# Altium project TFT-ESP32-V1.PrjPcb
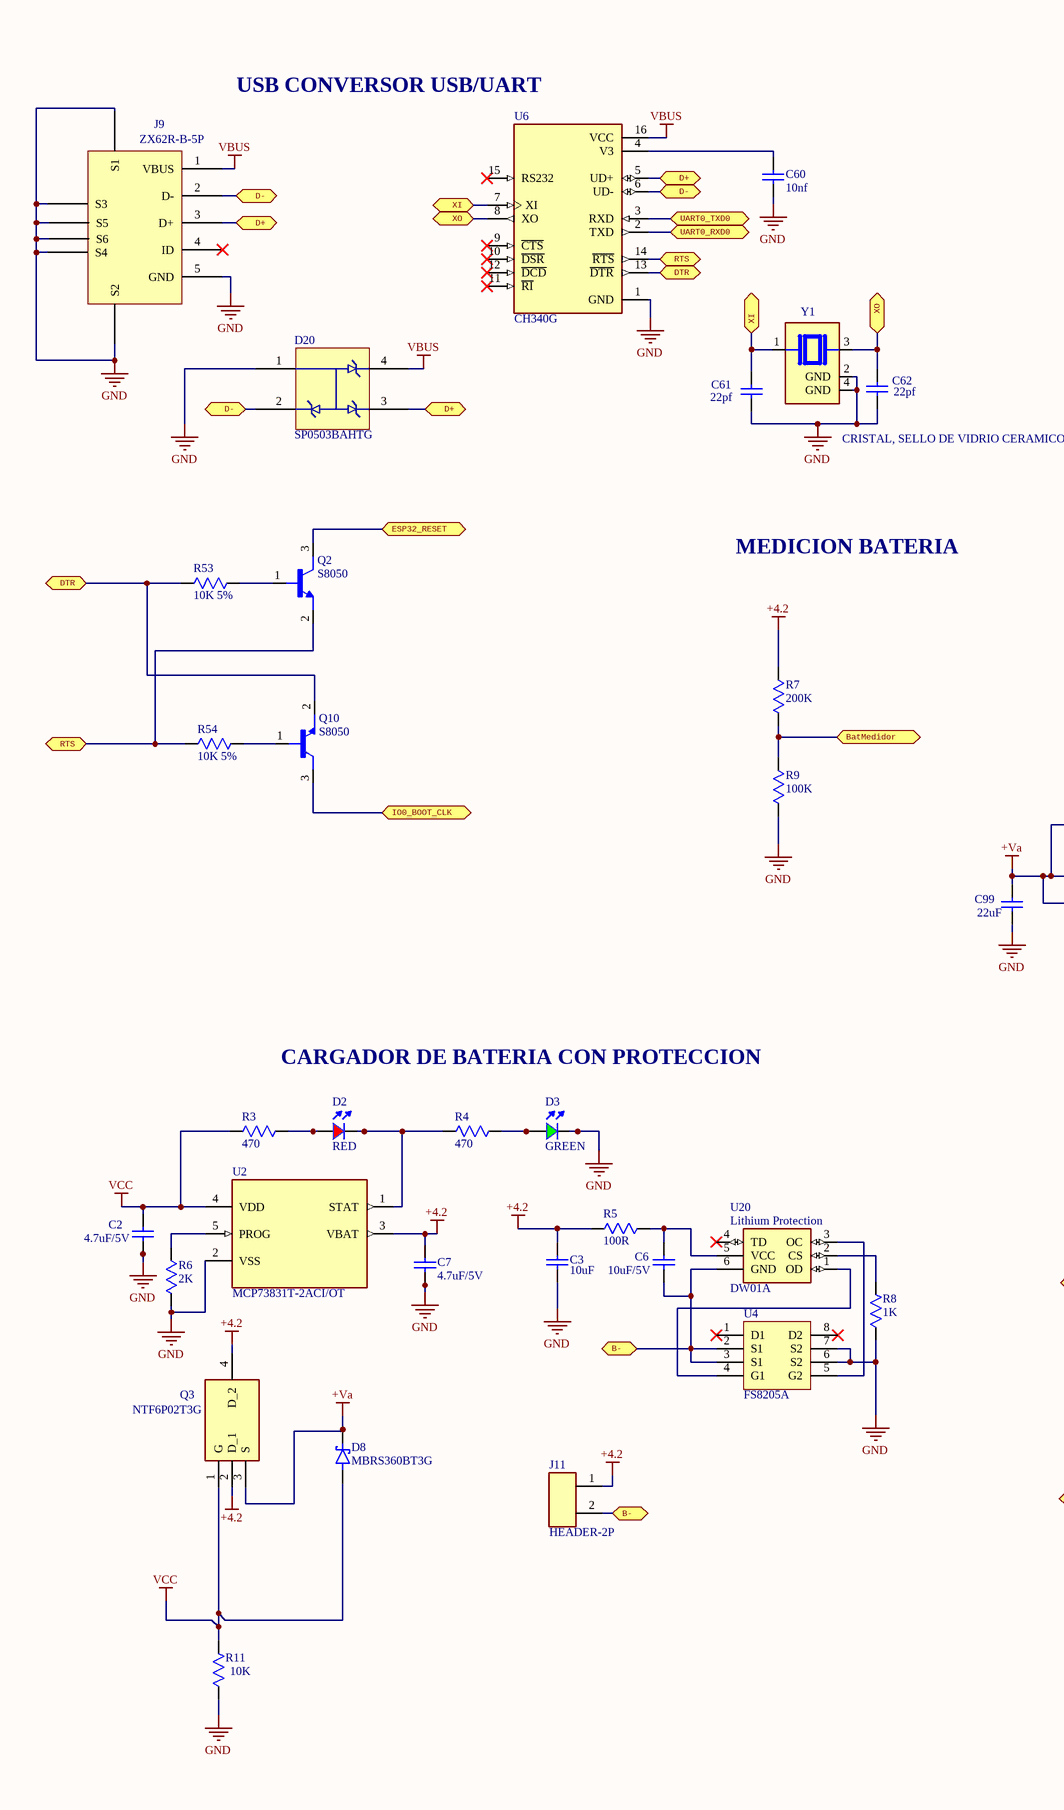
[diagram p0: TFT-ES32-V1.1.SchDoc, left]
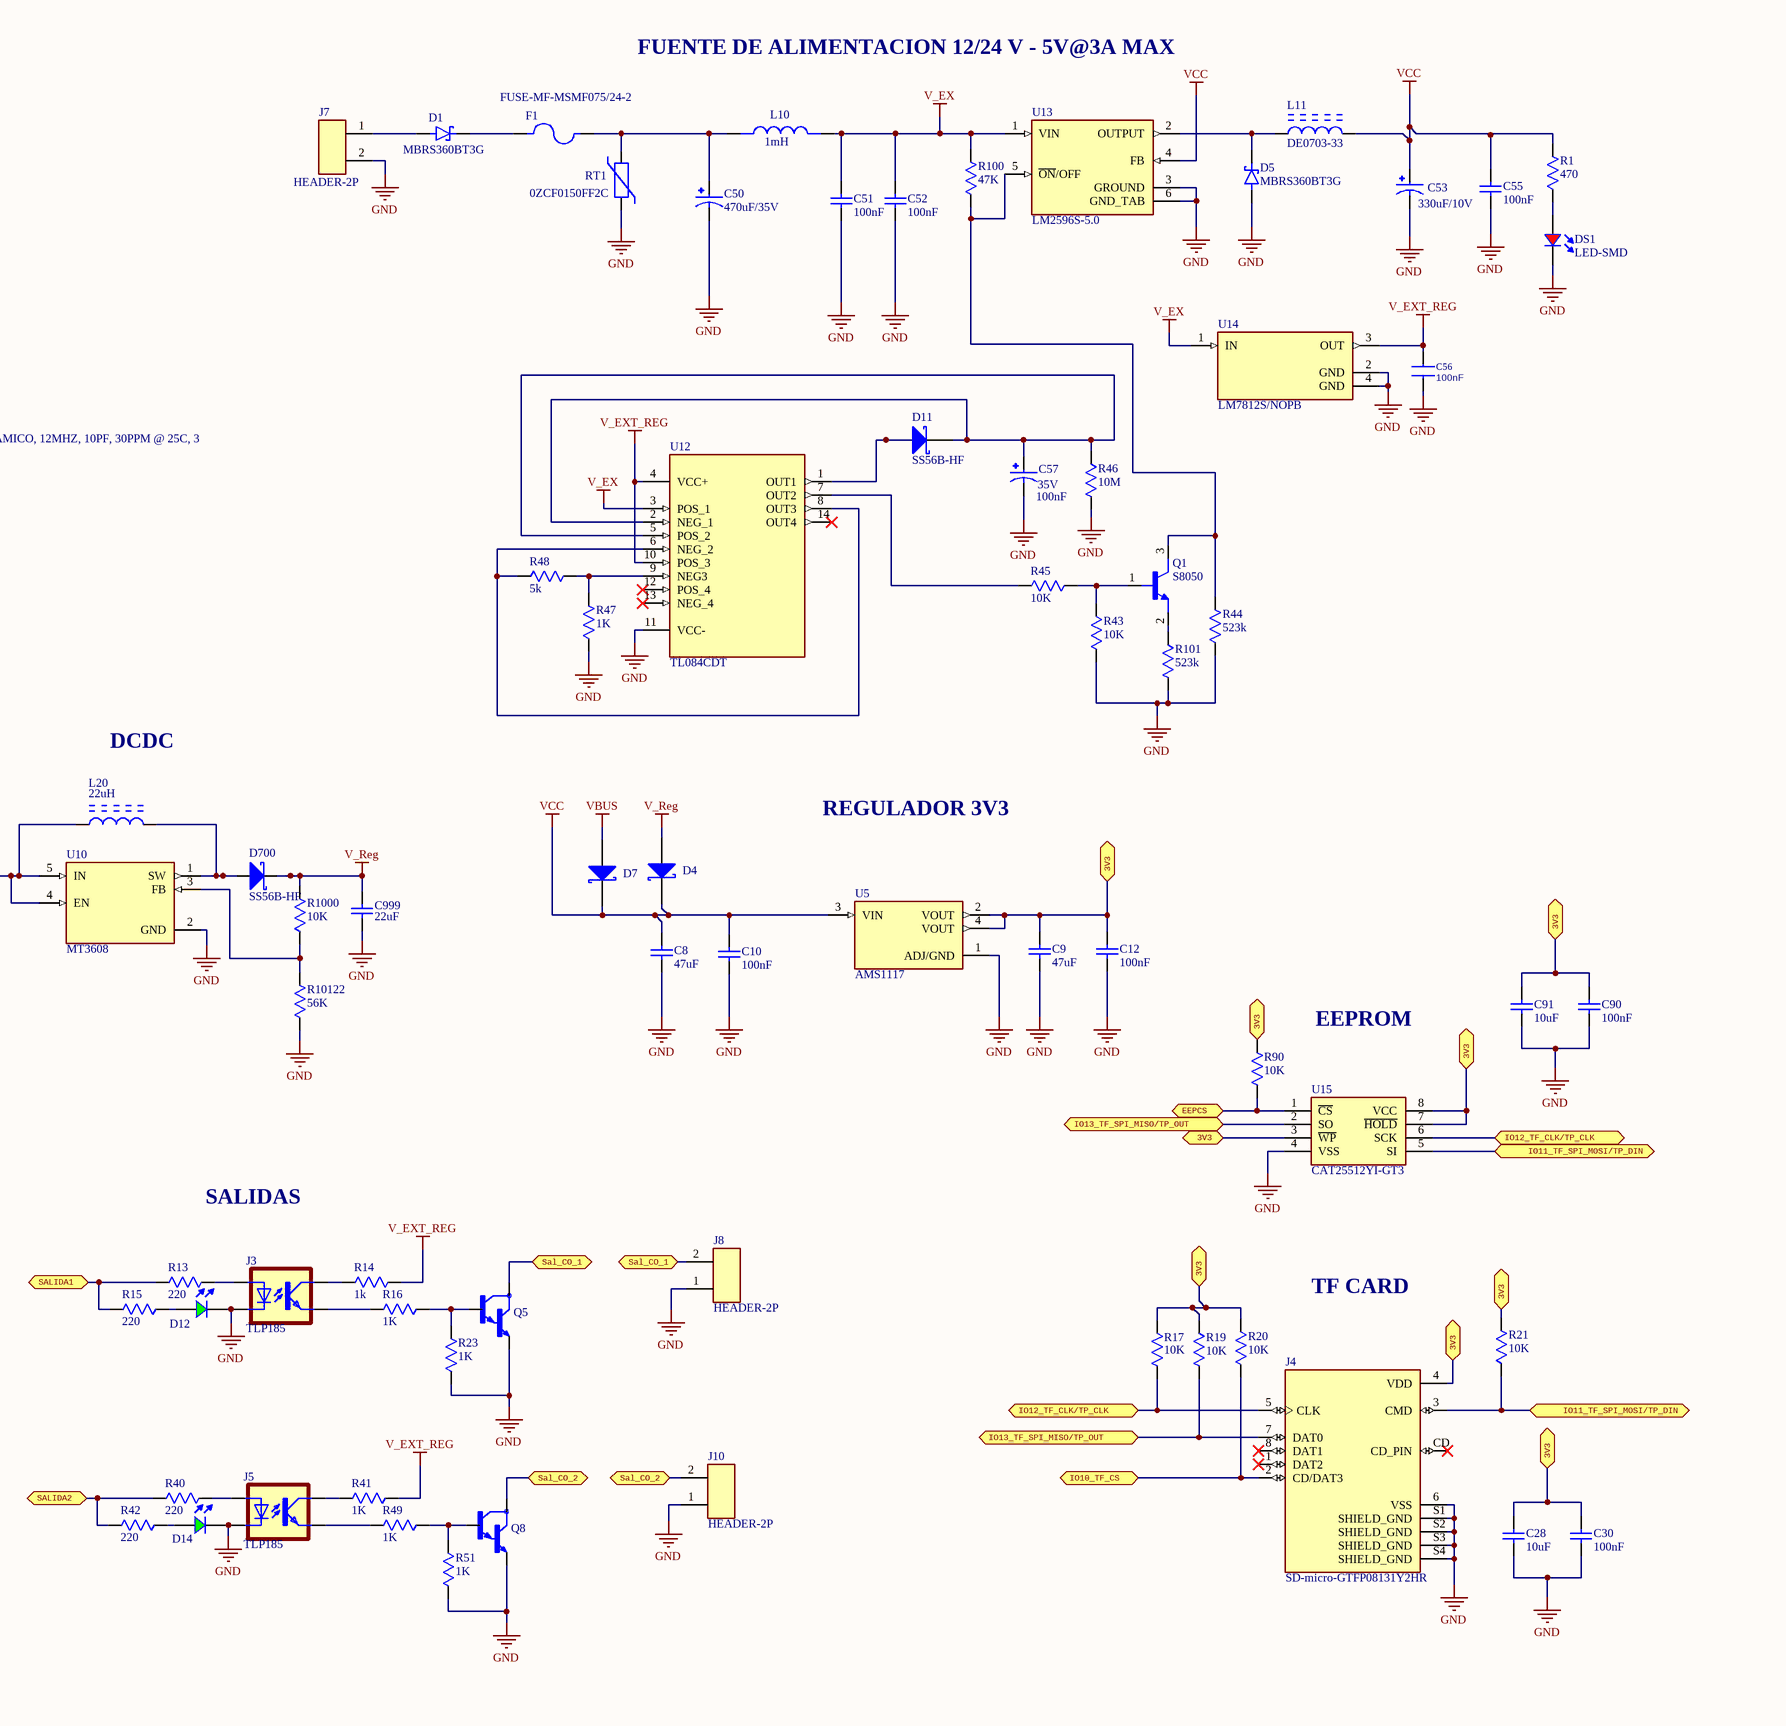
[diagram p1: TFT-ES32-V1.1.SchDoc, middle]
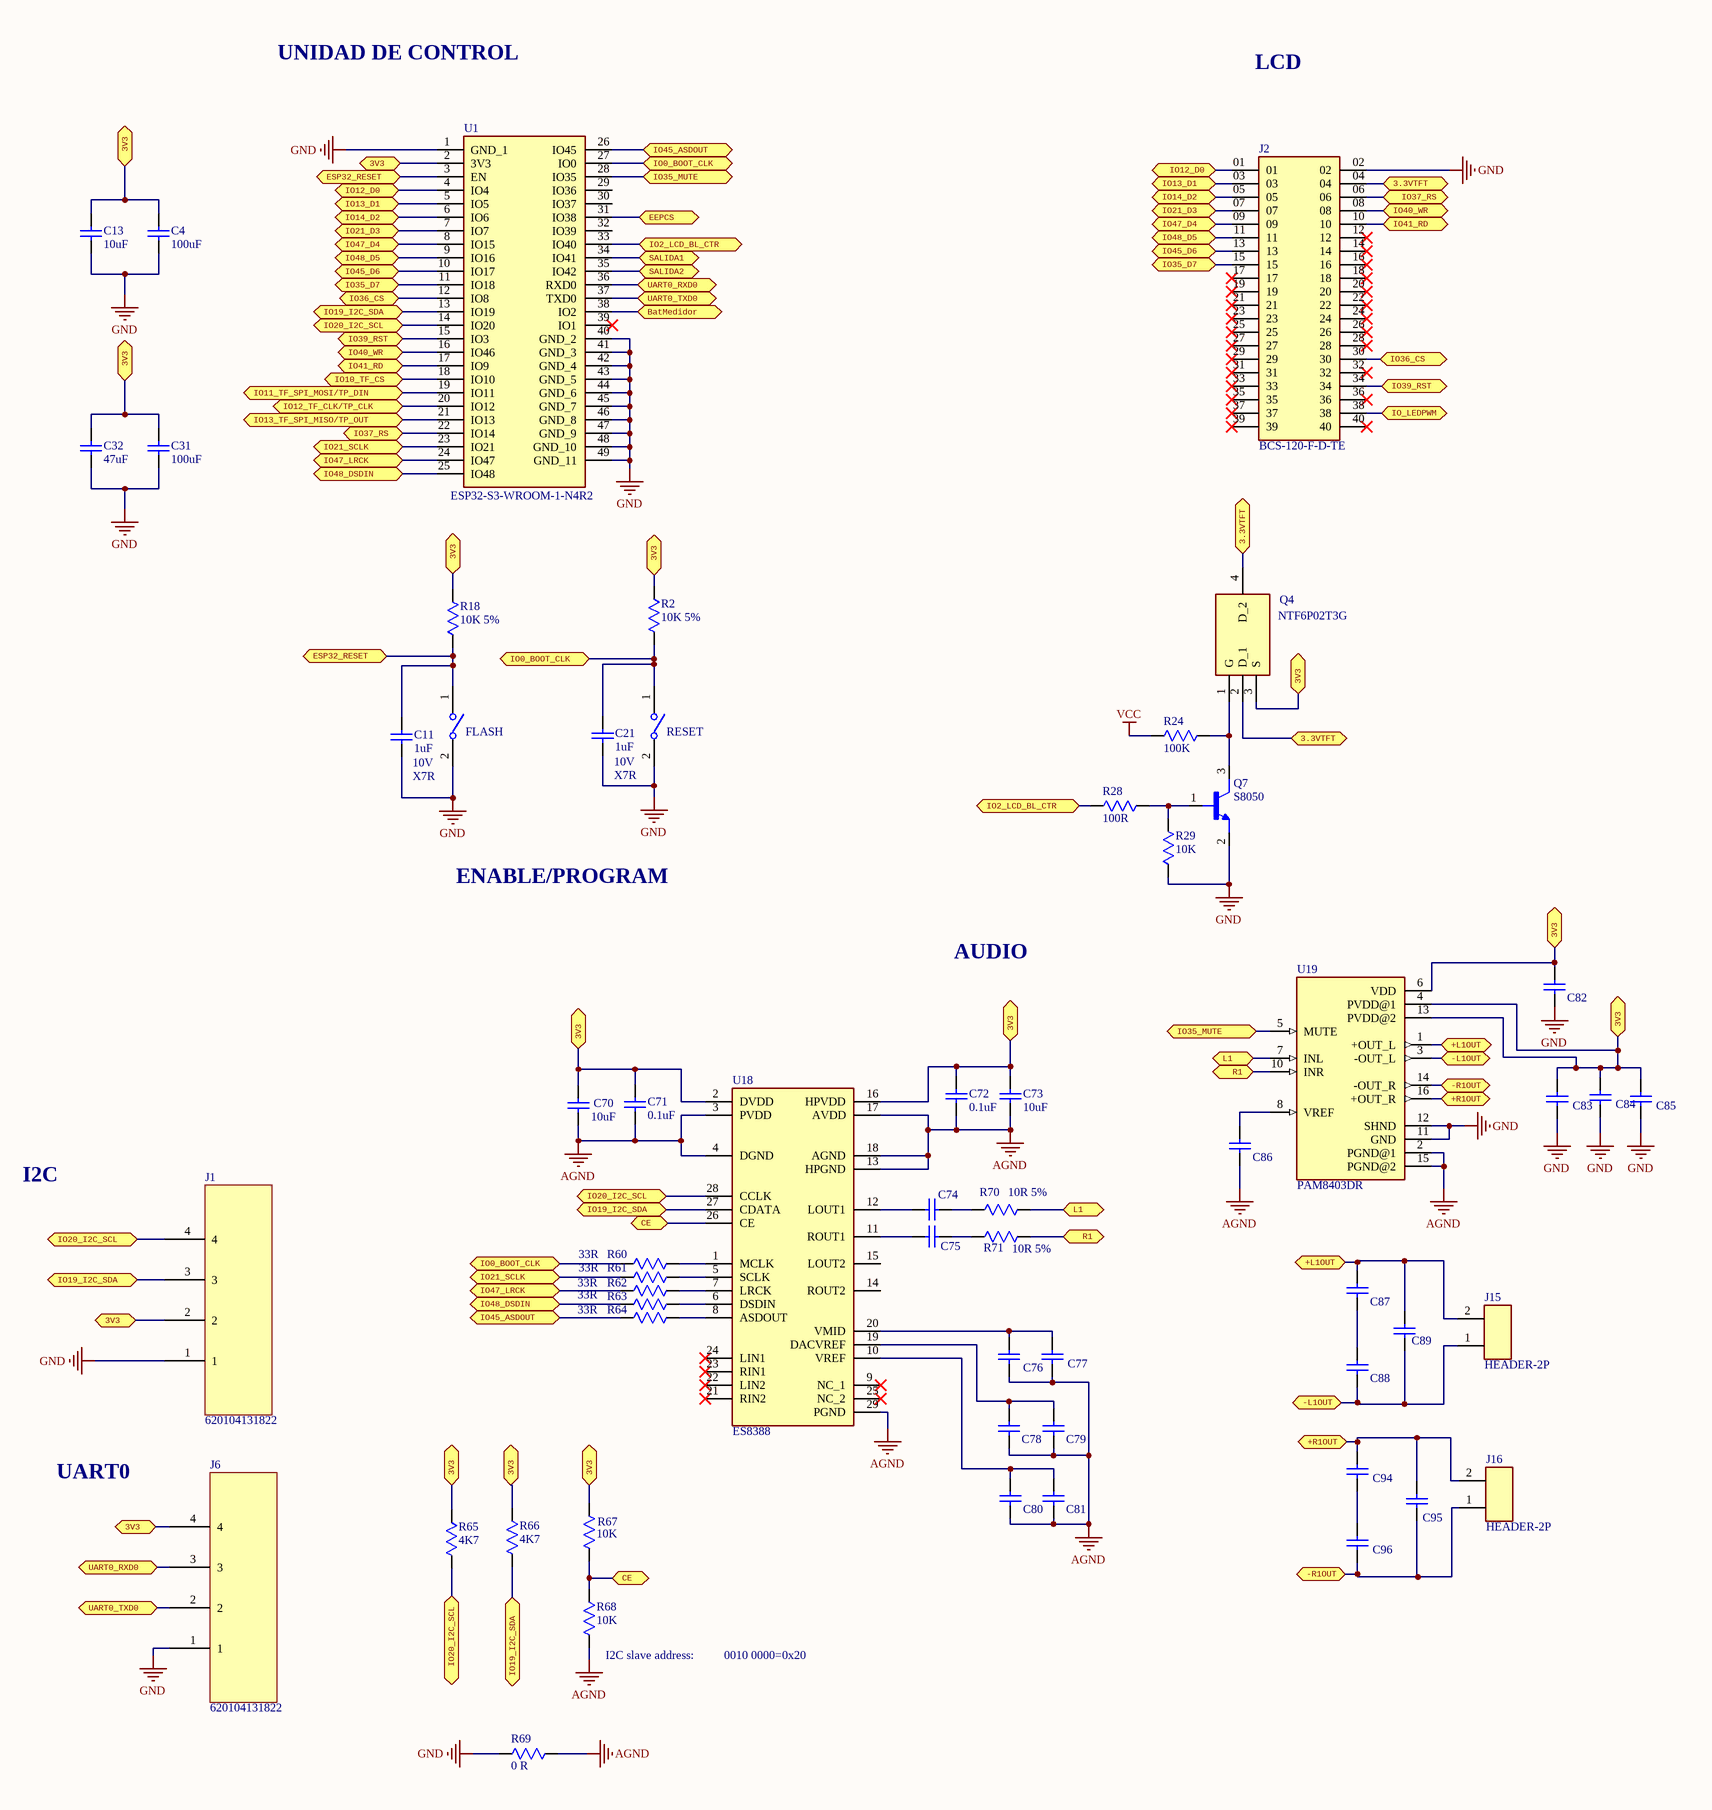
[diagram p2: TFT-ES32-V1.1.SchDoc, right]
1 sheet, 161 parts. Net scope: flat (ports and power ports of the same name join across sheets).
Board file: TFT-ES32-V1.PcbDoc

## Sheet TFT-ES32-V1.1.SchDoc
size 855 x 346 mm

### Parts
C2  4.7uF/5V  [C_0805-3D]
C3  10uF  [C_0805-3D]
C4  100uF  [C_0805-3D]
C6  10uF/5V  [C_0805-3D]
C7  4.7uF/5V  [C_0805-3D]
C8  47uF  [C_0805-3D]
C9  47uF  [C_0805-3D]
C10  100nF  [C_0805-3D]
C11  1uF  tension: 10V  tipo: X7R  [C_0805-3D]
C12  100nF  [C_0805-3D]
C13  10uF  [C_0805-3D]
C21  1uF  tension: 10V  tipo: X7R  [C_0805-3D]
C28  10uF  [C_0805-3D]
C30  100nF  [C_0805-3D]
C31  100uF  [C_0805-3D]
C32  47uF  [C_0805-3D]
C50  470uF/35V  [CAP_EEEFP1V221AV - duplicate]
C51  100nF  [C_0805-3D]
C52  100nF  [C_0805-3D]
C53  330uF/10V  [CAP_EEEFP1V221AV - duplicate]
C55  100nF  [C_0805-3D]
C56  100nF  [C_0805]
C57  value 100nF  max volt: 35V  [CAP_EEEFP1V221AV - duplicate]  (hidden comment: CAP)
C60  10nf  [C_0805-3D]
C61  value 22pf  [C_0805-3D]  (hidden comment: capacitor caramico)
C62  value 22pf  [C_0805-3D]  (hidden comment: capacitor caramico)
C70  10uF  [C_0805-3D]
C71  0.1uF  [C_0805-3D]
C72  0.1uF  [C_0805-3D]
C73  10uF  [C_0805-3D]
C74  capacitor caramico  [C_0805-3D]  (value not drawn)
C75  capacitor caramico  [C_0805-3D]  (value not drawn)
C76  capacitor caramico  [C_0805-3D]  (value not drawn)
C77  capacitor caramico  [C_0805-3D]  (value not drawn)
C78  capacitor caramico  [C_0805-3D]  (value not drawn)
C79  capacitor caramico  [C_0805-3D]  (value not drawn)
C80  capacitor caramico  [C_0805-3D]  (value not drawn)
C81  capacitor caramico  [C_0805-3D]  (value not drawn)
C82  capacitor caramico  [C_0805-3D]  (value not drawn)
C83  capacitor caramico  [C_0805-3D]  (value not drawn)
C84  capacitor caramico  [C_0805-3D]  (value not drawn)
C85  capacitor caramico  [C_0805-3D]  (value not drawn)
C86  capacitor caramico  [C_0805-3D]  (value not drawn)
C87  capacitor caramico  [C_0805-3D]  (value not drawn)
C88  capacitor caramico  [C_0805-3D]  (value not drawn)
C89  capacitor caramico  [C_0805-3D]  (value not drawn)
C90  100nF  [C_0805-3D]
C91  10uF  [C_0805-3D]
C94  capacitor caramico  [C_0805-3D]  (value not drawn)
C95  capacitor caramico  [C_0805-3D]  (value not drawn)
C96  capacitor caramico  [C_0805-3D]  (value not drawn)
C99  value 22uF  [C_0805-3D]  (hidden comment: capacitor caramico)
C999  value 22uF  [C_0805-3D]  (hidden comment: capacitor caramico)
D1  MBRS360BT3G  [DIOM5436X247N]
D2  RED  [D_0805-RED]
D3  GREEN  [D_0805-GREEN]
D4  SS56B-HF  [SS56B-HF DO-214AA (SMB)]  (value not drawn)
D5  MBRS360BT3G  [DIOM5436X247N]
D7  SS56B-HF  [SS56B-HF DO-214AA (SMB)]  (value not drawn)
D8  MBRS360BT3G  [DIOM5436X247N]
D11  SS56B-HF  [SS56B-HF DO-214AA (SMB)]
D12  LTST-C171GKT  [D_0805-GREEN]  (value not drawn)
D14  LTST-C171GKT  [D_0805-GREEN]  (value not drawn)
D20  SP0503BAHTG  [SOT143]
D700  SS56B-HF  [SS56B-HF DO-214AA (SMB)]
DS1  LED-SMD  [D_0805-RED]
F1  FUSE-MF-MSMF075/24-2  [FUSER_MF-MSMF075/24-2]
FLASH  buton-SMD  [SW_147873-2]  (value not drawn)
J1  620104131822  [620104131822]
J2  BCS-120-F-D-TE  [SAMTEC_BCS-120-F-D-TE]
J3  TLP185  [SOP-4-2.54MM]
J4  SD-micro-GTFP08131Y2HR  [AMPHENOL_GTFP08131Y2HR]
J5  TLP185  [SOP-4-2.54MM]
J6  620104131822  [620104131822]
J7  HEADER-2P  [620102131822]
J8  HEADER-2P  [620102131822]
J9  ZX62R-B-5P  [HRS_ZX62R-B-5P]
J10  HEADER-2P  [620102131822]
J11  HEADER-2P  [620102131822]
J15  HEADER-2P  [620102131822]
J16  HEADER-2P  [620102131822]
L10  1mH  [INDM5650X530N]
L11  DE0703-33  [DE0703-33]
L20  value 22uH  [DE0703-33]  (hidden comment: DE0703-33)
Q1  S8050  [SOT-23]
Q2  S8050  [SOT-23]
Q3  NTF6P02T3G  [SOT230P700X175-4N]
Q4  NTF6P02T3G  [SOT230P700X175-4N]
Q5  MJD122  [DPAK]  (value not drawn)
Q7  S8050  [SOT-23]
Q8  MJD122  [DPAK]  (value not drawn)
Q10  S8050  [SOT-23]
R1  470  [R_0805]
R2  10K 5%  [R_0805]
R3  470  [R_0805]
R4  470  [R_0805]
R5  100R  [R_0805]
R6  2K  [R_0805]
R7  200K  [R_0805]
R8  1K  [R_0805]
R9  100K  [R_0805]
R11  10K  [R_0805]
R13  220  [R_0805]
R14  1k  [R_0805]
R15  220  [R_0805]
R16  1K  [R_0805]
R17  10K  [R_0805]
R18  10K 5%  [R_0805]
R19  10K  [R_0805]
R20  10K  [R_0805]
R21  10K  [R_0805]
R23  1K  [R_0805]
R24  100K  [R_0805]
R28  100R  [R_0805]
R29  10K  [R_0805]
R40  220  [R_0805]
R41  1K  [R_0805]
R42  220  [R_0805]
R43  10K  [R_0805]
R44  523k  [R_0805]
R45  10K  [R_0805]
R46  10M  [R_0805]
R47  1K  [R_0805]
R48  5k  [R_0805]
R49  1K  [R_0805]
R51  1K  [R_0805]
R53  10K 5%  [R_0805]
R54  10K 5%  [R_0805]
R60  33R  [R_0805]
R61  33R  [R_0805]
R62  33R  [R_0805]
R63  33R  [R_0805]
R64  33R  [R_0805]
R65  4K7  [R_0805]
R66  4K7  [R_0805]
R67  10K  [R_0805]
R68  10K  [R_0805]
R69  0 R  [R_0805]
R70  10R 5%  [R_0805]
R71  10R 5%  [R_0805]
R90  10K  [R_0805]
R100  47K  [R_0805]
R101  523k  [R_0805]
R1000  10K  [R_0805]
R10122  56K  [R_0805]
RESET  buton-SMD  [SW_147873-2]  (value not drawn)
RT1  0ZCF0150FF2C  [0ZCF]
U1  ESP32-S3-WROOM-1-N4R2  [ESP32S3WROOM1N4R2]
U2  MCP73831T-2ACI/OT  [SOT95P280X145-5N]
U4  FS8205A  [SOP65P640X120-8N]
U5  AMS1117  [SOT229P700X180-4N]
U6  CH340G  [SOIC127P600X180-16N]
U10  MT3608  [SOT95P280X145-6N]
U12  TL084CDT  [SOIC127P600X175-14N]
U13  LM2596S-5.0  [TO170P1524X483-6N]
U14  LM7812S/NOPB  [TO254P1524X483-4N]
U15  CAT25512YI-GT3  [SOP65P640X120-8N]
U18  ES8388  [QFN45P400X400X90-29N-D]
U19  PAM8403DR  [SOIC127P605X150-16N]
U20  DW01A  [SOT-23-6]
Y1  CRISTAL, SELLO DE VIDRIO CERAMICO, 12MHZ, 10PF, 30PPM @ 25C, 3  [XTAL_ABM8G25000MHZB4YT3]

### Ports
3.3VTFT, 3V3, +L1OUT, +R1OUT, -L1OUT, -R1OUT, B-, BatMedidor, CE, D+, D-, DTR, EEPCS, ESP32_RESET, IO0_BOOT_CLK, IO2_LCD_BL_CTR, IO10_TF_CS, IO11_TF_SPI_MOSI/TP_DIN, IO12_D0, IO12_TF_CLK/TP_CLK, IO13_D1, IO13_TF_SPI_MISO/TP_OUT, IO14_D2, IO19_I2C_SDA, IO20_I2C_SCL, IO21_D3, IO21_SCLK, IO35_D7, IO35_MUTE, IO36_CS, IO37_RS, IO39_RST, IO40_WR, IO41_RD, IO45_ASDOUT, IO45_D6, IO47_D4, IO47_LRCK, IO48_D5, IO48_DSDIN, IO_LEDPWM, L1, R1, RTS, Sal_CO_1, Sal_CO_2, SALIDA1, SALIDA2, UART0_RXD0, UART0_TXD0, XI, XO

### Nets
+4.2: C3.1 C7.2 J11.1 Q3.2(D_1) Q3.4(D_2) R5.2 R7.2 U2.3(VBAT)
+Va: C99.1 D8.C(K) L20.1 Q3.3(S) U10.4(EN) U10.5(IN)
AGND: C70.1 C71.1 C72.1 C73.1 C76.1 C77.1 C78.1 C79.1 C80.1 C81.1 C86.2 R68.2 R69.2 U18.3(PVDD) U18.4(DGND) U18.13(HPGND) U18.17(AVDD) U18.18(AGND) U18.29(PGND) U19.2(PGND@1) U19.15(PGND@2)
GND: C2.1 C3.2 C4.1 C7.1 C8.2 C9.2 C10.1 C11.1 C12.1 C13.2 C21.1 C28.2 C30.1 C31.1 C32.2 C50.2 C51.2 C52.1 C53.2 C55.1 C56.1 C57.2 C60.1 C61.1 C62.1 C82.1 C83.1 C84.1 C85.1 C90.1 C91.2 C99.2 C999.1 D3.2 D5.A D12.2 D14.2 D20.1 DS1.2 FLASH.2 J1.1 J2.02 J3.CATHODE(C) J4.6(VSS) J4.S1(SHIELD_GND) J4.S2(SHIELD_GND) J4.S3(SHIELD_GND) J4.S4(SHIELD_GND) J5.CATHODE(C) J6.1 J7.2 J8.1 J9.5(GND) J9.12(S1) J9.13(S3) J9.14(S5) J9.15(S6) J9.16(S2) J9.17(S4) J10.1 Q5.3(E) Q7.2(E) Q8.3(E) R6.1 R8.1 R9.1 R11.2 R23.1 R29.1 R43.1 R44.1 R46.1 R47.1 R51.2 R69.1 R101.1 R10122.1 RESET.2 RT1.1 U1.1(GND_1) U1.40(GND_2) U1.41(GND_3) U1.42(GND_4) U1.43(GND_5) U1.44(GND_6) U1.45(GND_7) U1.46(GND_8) U1.47(GND_9) U1.48(GND_10) U1.49(GND_11) U2.2(VSS) U4.6(S2) U4.7(S2) U5.1(ADJ/GND) U6.1(GND) U10.2(GND) U12.11(VCC-) U13.3(GROUND) U13.6(GND_TAB) U14.2(GND) U14.4(GND) U15.4(VSS) U19.11(GND) U19.12(SHND) Y1.2(GND) Y1.4(GND)
V_EX: C51.1 C52.2 L10.2 R100.2 U12.3(POS_1) U13.1(VIN) U14.1(IN)
V_EXT_REG: C56.2 R14.2 R41.1 U12.4(VCC+) U12.10(POS_3) U14.3(OUT)
V_Reg: C999.2 D4.1 D700.2 R1000.2
VBUS: D7.1 D20.4 J9.1(VBUS) U6.16(VCC)
VCC: C2.2 C8.1 C10.2 C53.1 C55.2 D4.2 D7.2 D8.A L11.2 Q3.1(G) R1.2 R3.1 R11.1 R24.2 U2.4(VDD) U5.3(VIN) U13.4(FB)
NetC4_2: C4.2 C9.1 C12.2 C13.1 C28.1 C30.2 C31.2 C32.1 C70.2 C71.2 C72.2 C73.2 C82.2 C83.2 C84.2 C85.2 C90.2 C91.1 J1.2 J4.4(VDD) J6.4 Q4.3(S) R2.2 R17.2 R18.2 R19.2 R20.2 R21.2 R65.2 R66.2 R67.2 R90.2 U1.2(3V3) U5.2(VOUT) U5.4(VOUT) U15.3(~{WP}) U15.7(~{HOLD}) U15.8(VCC) U18.2(DVDD) U18.16(HPVDD) U19.4(PVDD@1) U19.6(VDD) U19.13(PVDD@2) ; port 3V3
NetC6_1: C6.1 R5.1 U20.5(VCC)
NetC6_2: C6.2 J11.2 U4.2(S1) U4.3(S1) U20.6(GND) ; port B-
NetC11_2: C11.2 FLASH.1 Q2.3(C) R18.1 U1.3(EN) ; port ESP32_RESET
NetC21_2: C21.2 Q10.3 R2.1 R60.1 RESET.1 U1.27(IO0) ; port IO0_BOOT_CLK
NetC50_1: C50.1 F1.2 L10.1 RT1.2
NetC57_1: C57.1 D11.2 R46.2 U12.2(NEG_1) U12.5(POS_2)
NetC60_2: C60.2 U6.4(V3)
NetC61_2: C61.2 U6.7(XI) Y1.1 ; port XI
NetC62_2: C62.2 U6.8(XO) Y1.3 ; port XO
NetC74_1: C74.1 U18.12(LOUT1)
NetC74_2: C74.2 R70.1
NetC75_1: C75.1 U18.11(ROUT1)
NetC75_2: C75.2 R71.1
NetC76_2: C76.2 C77.2 U18.20(VMID)
NetC78_2: C78.2 C79.2 U18.19(DACVREF)
NetC80_2: C80.2 C81.2 U18.10(VREF)
NetC86_1: C86.1 U19.8(VREF)
NetC87_1: C87.1 C89.2 J15.2 U19.1(+OUT_L) ; port +L1OUT
NetC87_2: C87.2 C88.1
NetC88_2: C88.2 C89.1 J15.1 U19.3(-OUT_L) ; port -L1OUT
NetC94_1: C94.1 C96.2
NetC94_2: C94.2 C95.2 J16.2 U19.16(+OUT_R) ; port +R1OUT
NetC95_1: C95.1 C96.1 J16.1 U19.14(-OUT_R) ; port -R1OUT
NetD1_A: D1.A J7.1
NetD1_C: D1.C(K) F1.1
NetD2_1: D2.1 R3.2
NetD2_2: D2.2 R4.1 U2.1(STAT)
NetD3_1: D3.1 R4.2
NetD5_C: D5.C(K) L11.1 U13.2(OUTPUT)
NetD11_1: D11.1 U12.1(OUT1)
NetD12_1: D12.1 R15.2
NetD14_1: D14.1 R42.1
NetD20_2: D20.2 J9.2(D-) U6.6(UD-) ; port D-
NetD20_3: D20.3 J9.3(D+) U6.5(UD+) ; port D+
NetD700_1: D700.1 L20.2 U10.1(SW)
NetDS1_1: DS1.1 R1.1
NetJ1_3: J1.3 R66.1 U1.13(IO19) U18.27(CDATA) ; port IO19_I2C_SDA
NetJ1_4: J1.4 R65.1 U1.14(IO20) U18.28(CCLK) ; port IO20_I2C_SCL
NetJ2_01: J2.01 U1.4(IO4) ; port IO12_D0
NetJ2_03: J2.03 U1.5(IO5) ; port IO13_D1
NetJ2_04: J2.04 Q4.2(D_1) Q4.4(D_2) ; port 3.3VTFT
NetJ2_05: J2.05 U1.6(IO6) ; port IO14_D2
NetJ2_06: J2.06 U1.22(IO14) ; port IO37_RS
NetJ2_07: J2.07 U1.7(IO7) ; port IO21_D3
NetJ2_08: J2.08 U1.16(IO46) ; port IO40_WR
NetJ2_09: J2.09 U1.8(IO15) ; port IO47_D4
NetJ2_10: J2.10 U1.17(IO9) ; port IO41_RD
NetJ2_11: J2.11 U1.9(IO16) ; port IO48_D5
NetJ2_13: J2.13 U1.10(IO17) ; port IO45_D6
NetJ2_15: J2.15 U1.11(IO18) ; port IO35_D7
NetJ2_30: J2.30 U1.12(IO8) ; port IO36_CS
NetJ2_34: J2.34 U1.15(IO3) ; port IO39_RST
NetJ2_38: J2.38 ; port IO_LEDPWM
NetJ3_ANODE: J3.ANODE(A) R13.2
NetJ3_COLLECTOR: J3.COLLECTOR(COL) R14.1
NetJ3_EMITTER: J3.EMITTER(EMIT) R16.1
NetJ4_2: J4.2(CD/DAT3) R20.1 U1.18(IO10) ; port IO10_TF_CS
NetJ4_3: J4.3(CMD) R21.1 U1.19(IO11) U15.5(SI) ; port IO11_TF_SPI_MOSI/TP_DIN
NetJ4_5: J4.5(CLK) R17.1 U1.20(IO12) U15.6(SCK) ; port IO12_TF_CLK/TP_CLK
NetJ4_7: J4.7(DAT0) R19.1 U1.21(IO13) U15.2(SO) ; port IO13_TF_SPI_MISO/TP_OUT
NetJ5_ANODE: J5.ANODE(A) R40.1
NetJ5_COLLECTOR: J5.COLLECTOR(COL) R41.2
NetJ5_EMITTER: J5.EMITTER(EMIT) R49.2
NetJ6_2: J6.2 U1.37(TXD0) U6.3(RXD) ; port UART0_TXD0
NetJ6_3: J6.3 U1.36(RXD0) U6.2(TXD) ; port UART0_RXD0
NetJ8_2: J8.2 Q5.4(C) ; port Sal_CO_1
NetJ10_2: J10.2 Q8.4(C) ; port Sal_CO_2
NetQ1_1: Q1.1(B) R43.2 R45.2
NetQ1_2: Q1.2(E) R101.2
NetQ1_3: Q1.3(C) R44.2 R100.1 U13.5(~{ON}/OFF)
NetQ2_1: Q2.1(B) R53.2
NetQ2_2: Q2.2(E) R54.1 U6.14(~{RTS}) ; port RTS
NetQ4_1: Q4.1(G) Q7.3(C) R24.1
NetQ5_1: Q5.1(B) R16.2 R23.2
NetQ7_1: Q7.1(B) R28.1 R29.2
NetQ8_1: Q8.1(B) R49.1 R51.1
NetQ10_1: Q10.1(B) R54.2
NetQ10_2: Q10.2(E) R53.1 U6.13(~{DTR}) ; port DTR
NetR6_2: R6.2 U2.5(PROG)
NetR7_1: R7.1 R9.2 U1.38(IO2) ; port BatMedidor
NetR8_2: R8.2 U20.2(CS)
NetR13_1: R13.1 R15.1 U1.34(IO41) ; port SALIDA1
NetR28_2: R28.2 U1.33(IO40) ; port IO2_LCD_BL_CTR
NetR40_2: R40.2 R42.2 U1.35(IO42) ; port SALIDA2
NetR45_1: R45.1 U12.7(OUT2)
NetR47_2: R47.2 R48.2 U12.9(NEG3)
NetR48_1: R48.1 U12.6(NEG_2) U12.8(OUT3)
NetR60_2: R60.2 U18.1(MCLK)
NetR61_1: R61.1 U1.23(IO21) ; port IO21_SCLK
NetR61_2: R61.2 U18.5(SCLK)
NetR62_1: R62.1 U1.24(IO47) ; port IO47_LRCK
NetR62_2: R62.2 U18.7(LRCK)
NetR63_1: R63.1 U1.25(IO48) ; port IO48_DSDIN
NetR63_2: R63.2 U18.6(DSDIN)
NetR64_1: R64.1 U1.26(IO45) ; port IO45_ASDOUT
NetR64_2: R64.2 U18.8(ASDOUT)
NetR67_1: R67.1 R68.1 U18.26(CE) ; port CE
NetR70_2: R70.2 U19.7(INL) ; port L1
NetR71_2: R71.2 U19.10(INR) ; port R1
NetR90_1: R90.1 U1.31(IO38) U15.1(~{CS}) ; port EEPCS
NetR1000_1: R1000.1 R10122.2 U10.3(FB)
NetU1_28: U1.28(IO35) U19.5(MUTE) ; port IO35_MUTE
NetU4_4: U4.4(G1) U20.1(OD)
NetU4_5: U4.5(G2) U20.3(OC)

Not connected (* = marked no-connect by the designer): J2 12* 14* 16* 17* 18* 19* 20* 21* 22* 23* 24* 25* 26* 27* 28* 29* 31* 32* 33* 35* 36* 37* 39* 40*; J4 1(DAT2)* 8(DAT1)* CD(CD_PIN)*; J9 4(ID)*; U1 29(IO36) 30(IO37) 32(IO39) 39(IO1)*; U4 1(D1)* 8(D2)*; U6 9(~{CTS})* 10(~{DSR})* 11(~{RI})* 12(~{DCD})* 15(RS232)*; U12 12(POS_4)* 13(NEG_4)* 14(OUT4)*; U18 9(NC_1)* 14(ROUT2) 15(LOUT2) 21(RIN2)* 22(LIN2)* 23(RIN1)* 24(LIN1)* 25(NC_2)*; U20 4(TD)*

### Notes on the sheet
- FUENTE DE ALIMENTACION 12/24 V - 5V@3A MAX
- UNIDAD DE CONTROL
- LCD
- USB CONVERSOR USB/UART
- MEDICION BATERIA
- DCDC
- REGULADOR 3V3
- ENABLE/PROGRAM
- AUDIO
- EEPROM
- CARGADOR DE BATERIA CON PROTECCION
- SALIDAS
- I2C
- TF CARD
- UART0
- (near R68) I2C slave address:          0010 0000=0x20
- (in symbol DW01A) Lithium Protection

### Library data of the parts
C2-C4 C6-C13 C21 C28 C30-C32 C51 C52 C55 C60-C62 C70-C91 C94-C96 C99 C999 = capacitor caramico: capacitor ceramico 0805
C50 C53 = CAP_EEEFP1V221AV: CAP ALUM; max volt: 50V
C56 = CapMix: Capacitor; Value: 100nF
C57 = CAP_EEEFP1V221AV: CAP ALUM
D1 D5 D8 = MBRS360BT3G: Diode Schottky 60V 3A Surface Mount SMB
D2 DS1 = LED-SMD: led 0805 red
D3 = LED-SMD-GREEN: value: LTST-C171GKT
D4 D7 D11 D700 = SS56B-HF: Diodo Schottky 60 V 5A Montaje en superficie DO-214AA (SMB); part number: SS56B-HF; value: Diodo Schottky 60 V 5A; pakage: DO-214AA (SMB)
D12 D14 = LED-SMD-GREEN
D20 = SP0503BAHTG: Supresor ESD TVS Uni-Dir 5.5V 4-Pin SOT-143 T/R
F1 = FUSE-MF-MSMF075/24-2: Polymeric PTC Resettable Fuse 24V 750 mA Ih Surface Mount 1812 (4532 Metric), Concave
J1 J6 = 620104131822: Connector Header Surface Mount, Right Angle 4 position 0.079" (2.00mm); MP: WurthElektronik
J2 = BCS-120-F-D-TE: CONNECTOR, RECEPTACLE, 40 CONTACTS, 2 ROWS, THROUGH HOLE, 2.54 MM; Connector Systems:Board-to-Board; Pitch Spacing:2.54mm; No. of Rows:2Rows; No. of Contacts:40Contacts; Connector Mounting:Through Hole Mount; Gender:Receptacle RoHS Compliant: Yes
J3 J5 = TLP185: Optoisolator Transistor Output 3750Vrms 1 Channel 6-SOP; MF: Toshiba; Price: None; Availability: In Stock; MP: TLP185; Package: None; SnapEDA_Link: https://www.snapeda.com/parts/TLP185/Toshiba/view-part/?ref=snap; Check_prices: https://www.snapeda.com/parts/TLP185/Toshiba/view-part/?ref=eda; Value: *; Purchase-URL: https://pricing.snapeda.com/search/part/TLP185/?ref=eda
J4 = SD-micro-GTFP08131Y2HR: GTFP08131Y2HR  MICRO SD,P/P,LCP; MF: GTFP08131Y2HR
J7 J8 J10 J11 J15 J16 = HEADER-2P-620102131822: Connector Header Surface Mount, Right Angle 2 position 0.079 _2.00mm_
J9 = USB-ZX62R-B-5P: ZX62R-B-5P USB STM; tecnoligi: SMD; value: ZX62R-B-5P
L10 = B82442T1105K050: INDUCTOR, 2220A, 1000UH, 0.246A, 10%; Inductance:1mH; Inductance Tolerance:Â± 10%; DC Resistance Max:9.5ohm; DC Current Rating:150mA; Series:SIMID; Core Material:Ferrite; Inductor Case Style:2220; No. of Pins:2; Core Material:Ferrite; DC Current Max:150mA; Inductor Type:Laser Cut; Package / Case:2220; Q @ Vr F:20; Q Factor @ Frequency:20 @ 252kHz; Resistance:9.5ohm; Resonant Frequency:1.8MHz
L11 L20 = DE0703-33: Inductor: alambre; SMD; 33uH; 910mA; 240 mΩ; 7,3x7,3x3,2 mm; ±20%
Q1 Q2 Q7 = transistor-smd-NPN-BJT: Transistor bipolar (BJT) NPN 25 V 500 mA 150 MHz 300 mW Montaje en superficie SOT-23
Q3 Q4 = NTF6P02T3G: 10A, 20V, 0.05ohm, P-CHANNEL, Si, POWER, MOSFET, TO-261AA, CASE 318E-04, TO-261, 4 PIN
Q5 Q8 = MJD122: Bipolar _BJT_ Transistor NPN - Darlington 100V 8A 4MHz 1.75W Surface Mount DPAK; MF: ON Semiconductor
Q10 = transistor-smd-NPN-BJT-espejado: Transistor bipolar (BJT) NPN 25 V 500 mA 150 MHz 300 mW Montaje en superficie SOT-23
R1-R9 R11 R13-R21 R23 R24 R28 R29 R40-R49 R51 R53 R54 R60-R71 R90 R100 R101 R1000 R10122 = Resistor
RT1 = 0ZCF0150FF2C: PPTC (Polyswitch); Vendor: Belfuse; Manufacturer_Part_Number: 0ZCF0150FF2C; Type: Type; RefDes: RefDes
U1 = ESP32-S3-WROOM-1-N4R2: Bluetooth, WiFi 802.11b/g/n, Bluetooth v5.0 Transceiver Module 2.4GHz PCB Trace Surface Mount
U2 = MCP73831T-2ACI/OT: Charger IC Lithium Ion/Polymer SOT-23-5; MF: Microchip; MP: MCP73831T-2ACI/OT; package: SOT-23 Microchip
U5 = AMS1117: 1A LOW DROPOUT VOLTAGE REGULATOR SOT-223; MP: AMS1117; MF: SOT-223
U6 = CH340G: USB Interface Integrated Circuit; MF: WCH; MP: CH340G
U10 = MT3608: High Efficiency 1.2MHz 2A Step Up Converter; MF: Aerosemi Technology Co., Ltd; MB: MT3608
U12 = TL084CDT: General purpose JFET quad operational amplifiers; MP: TL084CDT
U13 = LM2596S-5.0: SIMPLE SWITCHER&reg; 4.5V to 40V, 3A Low Component Count Step-Down Regulator
U14 = LM7812S/NOPB: 1.5-A, 30-V, linear voltage regulator 3-DDPAK/TO-263 0 to 125; MP: LM7812S/NOPB; pakage: 3-DDPAK/TO-263
U15 = CAT25512YI-GT3: EEPROM 512KB SPI SER CMOS EEPROM
U18 = ES8388: Low Power Stereo Audio CODEC With Headphone Amplifier; MP: Everest; MF: ES8388
U19 = PAM8403DR: Amplifier IC 2-Channel _Stereo_ Class D 16-SOP; MF: Diodes Incorporated; MP: PAM8403DR
U20 = DW01A: One Cell Lithium-ion/Polymer Battery Protection IC
Y1 = ABM8G25000MHZB4YT3: MF: Abracon; MP: ABM8G25000MHZB4YT3